# Altium schematic sheet pH_EZO_2.SchDoc
size A4
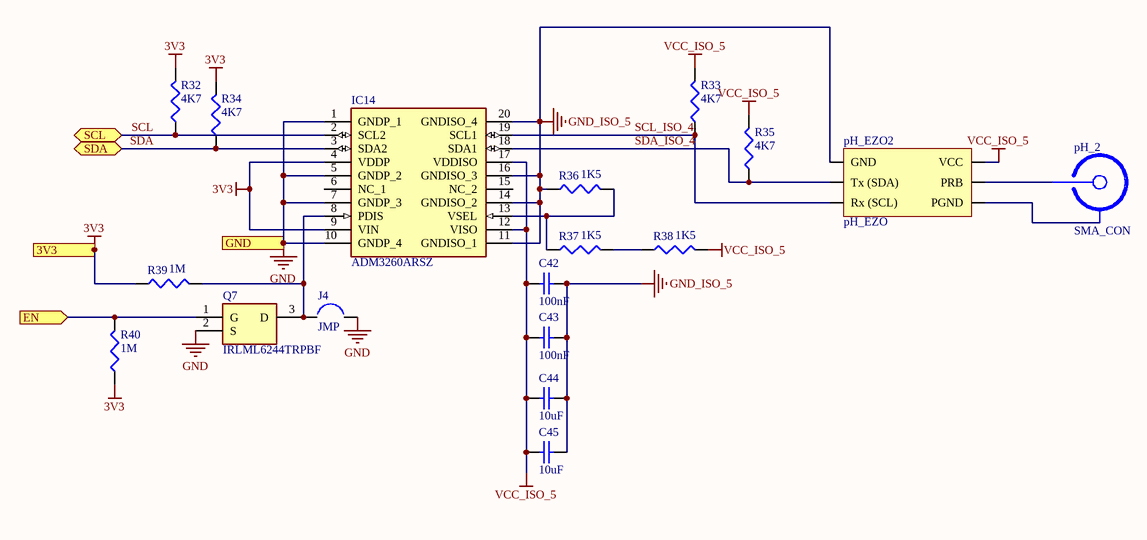
[diagram p0: pH_EZO_2.SchDoc]

## Parts
C42  100nF  [1608[0603]]
C43  100nF  [1608[0603]]
C44  10uF  [1608[0603]]
C45  10uF  [1608[0603]]
IC14  ADM3260ARSZ  [SOP65P780X200-20N]
J4  JMP  [Jumper]
pH_2  SMA_CON  [PCBSMAFRAHT]
pH_EZO2  pH_EZO  [Ph_ezo]
Q7  IRLML6244TRPBF  [SOT95P237X112-3N]
R32  4K7  [J1-0603]
R33  4K7  [J1-0603]
R34  4K7  [J1-0603]
R35  4K7  [J1-0603]
R36  1K5  [J1-0603]
R37  1K5  [J1-0603]
R38  1K5  [J1-0603]
R39  1M  [J1-0603]
R40  1M  [J1-0603]

## Ports
3V3, EN (in), GND, SCL (bidir), SDA (bidir)

## Nets
3V3: IC14.4(VDDP) IC14.9(VIN) R32.2 R34.2 R39.1 R40.1 ; port 3V3
GND: IC14.1(GNDP_1) IC14.5(GNDP_2) IC14.7(GNDP_3) IC14.10(GNDP_4) J4.2 Q7.2(S) ; port GND
GND_ISO_5: C42.2 C43.2 C44.2 C45.2 IC14.11(GNDISO_1) IC14.14(GNDISO_2) IC14.16(GNDISO_3) IC14.20(GNDISO_4) pH_EZO2.1(GND) R36.1
VCC_ISO_5: C42.1 C43.1 C44.1 C45.1 IC14.12(VISO) IC14.17(VDDISO) pH_EZO2.4(VCC) R33.2 R35.2 R38.2
EN: Q7.1(G) R40.2 ; port EN
SCL: IC14.2(SCL2) R32.1 ; port SCL
SCL_ISO_4: IC14.19(SCL1) pH_EZO2.3(Rx_(SCL)) R33.1
SDA: IC14.3(SDA2) R34.1 ; port SDA
SDA_ISO_4: IC14.18(SDA1) pH_EZO2.2(Tx_(SDA)) R35.1
NetIC14_8: IC14.8(PDIS) J4.1 Q7.3(D) R39.2
NetIC14_13: IC14.13(VSEL) R36.2 R37.1
NetpH_2_1: pH_2.1 pH_EZO2.5(PRB)
NetpH_2_2: pH_2.2 pH_EZO2.6(PGND)
NetR37_2: R37.2 R38.1

Not connected (* = marked no-connect by the designer): IC14 6(NC_1) 15(NC_2)

## Library data of the parts
C42 C43 = Cap Semi: Capacitor (Semiconductor SIM Model); Published: 8-Jun-2000; LatestRevisionDate: 29-May-2009; LatestRevisionNote: IPC-7351 Footprint Added.; PackageReference: C1206; Publisher: Altium Limited; PackageDescription: Chip Capacitor; Value: 100nF
C44 C45 = Cap Semi: Capacitor (Semiconductor SIM Model); Value: 100nF; Published: 8-Jun-2000; LatestRevisionDate: 29-May-2009; LatestRevisionNote: IPC-7351 Footprint Added.; PackageReference: C1206; Publisher: Altium Limited; PackageDescription: Chip Capacitor
IC14 = ADM3260ARSZ: Integrated Circuit; Manufacturer_Name: Analog Devices; Datasheet Link: http://www.farnell.com/datasheets/2037088.pdf; Height: 2mm; Manufacturer_Part_Number: ADM3260ARSZ; Mouser Part Number: 584-ADM3260ARSZ; Mouser Price/Stock: https://www.mouser.com/Search/Refine.aspx?Keyword=584-ADM3260ARSZ; RS Part Number: 8319113P; RS Price/Stock: http://uk.rs-online.com/web/p/products/8319113P
pH_2 = SMA: Connector; Manufacturer_Name: Taoglas; Manufacturer_Part_Number: PCB.SMAFRA.HT; Datasheet Link: https://www.mouser.com/datasheet/2/398/PCB.SMAFRA.HT_-1220750.pdf; Height: 9mm; Mouser Part Number: 960-PCB.SMAFRA.HT; Mouser Price/Stock: https://www.mouser.co.uk/ProductDetail/Taoglas/PCBSMAFRAHT?qs=RuW%2Fu%252BNMQmubIFYcN8w5Dw%3D%3D
Q7 = IRLML6244TRPBF: Transistor; Manufacturer_Name: Infineon; Allied_Number: 70411468; Datasheet Link: http://www.infineon.com/dgdl/irlml6244pbf.pdf?fileId=5546d462533600a4015356686fed261f; Height: 1.12mm; Manufacturer_Part_Number: IRLML6244TRPBF; Mouser Part Number: 942-IRLML6244TRPBF; Mouser Price/Stock: https://www.mouser.com/Search/Refine.aspx?Keyword=942-IRLML6244TRPBF; RS Part Number: 7377228P; RS Price/Stock: http://at.rs-online.com/web/p/products/7377228P; Allied Price/Stock: https://www.alliedelec.com/infineon-irlml6244trpbf/70411468/
R32-R40 = Res3: Resistor; Published: 8-Jun-2000; LatestRevisionDate: 29-May-2009; LatestRevisionNote: IPC-7351 Footprint Added.; PackageReference: J1-0603; Publisher: Altium Limited; PackageDescription: Chip Resistor
  R32-R35: Value: 4K7
  R36-R38: Value: 1K5
  R39 R40: Value: 1M